# Altium schematic sheet sptArrayX2.SCHDOC: LiveDesign Evaluation - Video Games
size C; Organization: Altium Limited; Address1: L3, 12a Rodborough Rd; Address2: Frenchs Forest; Address3: NSW; Address4: Australia 2086; DocumentNumber: 7; SheetNumber: 7; SheetTotal: 11
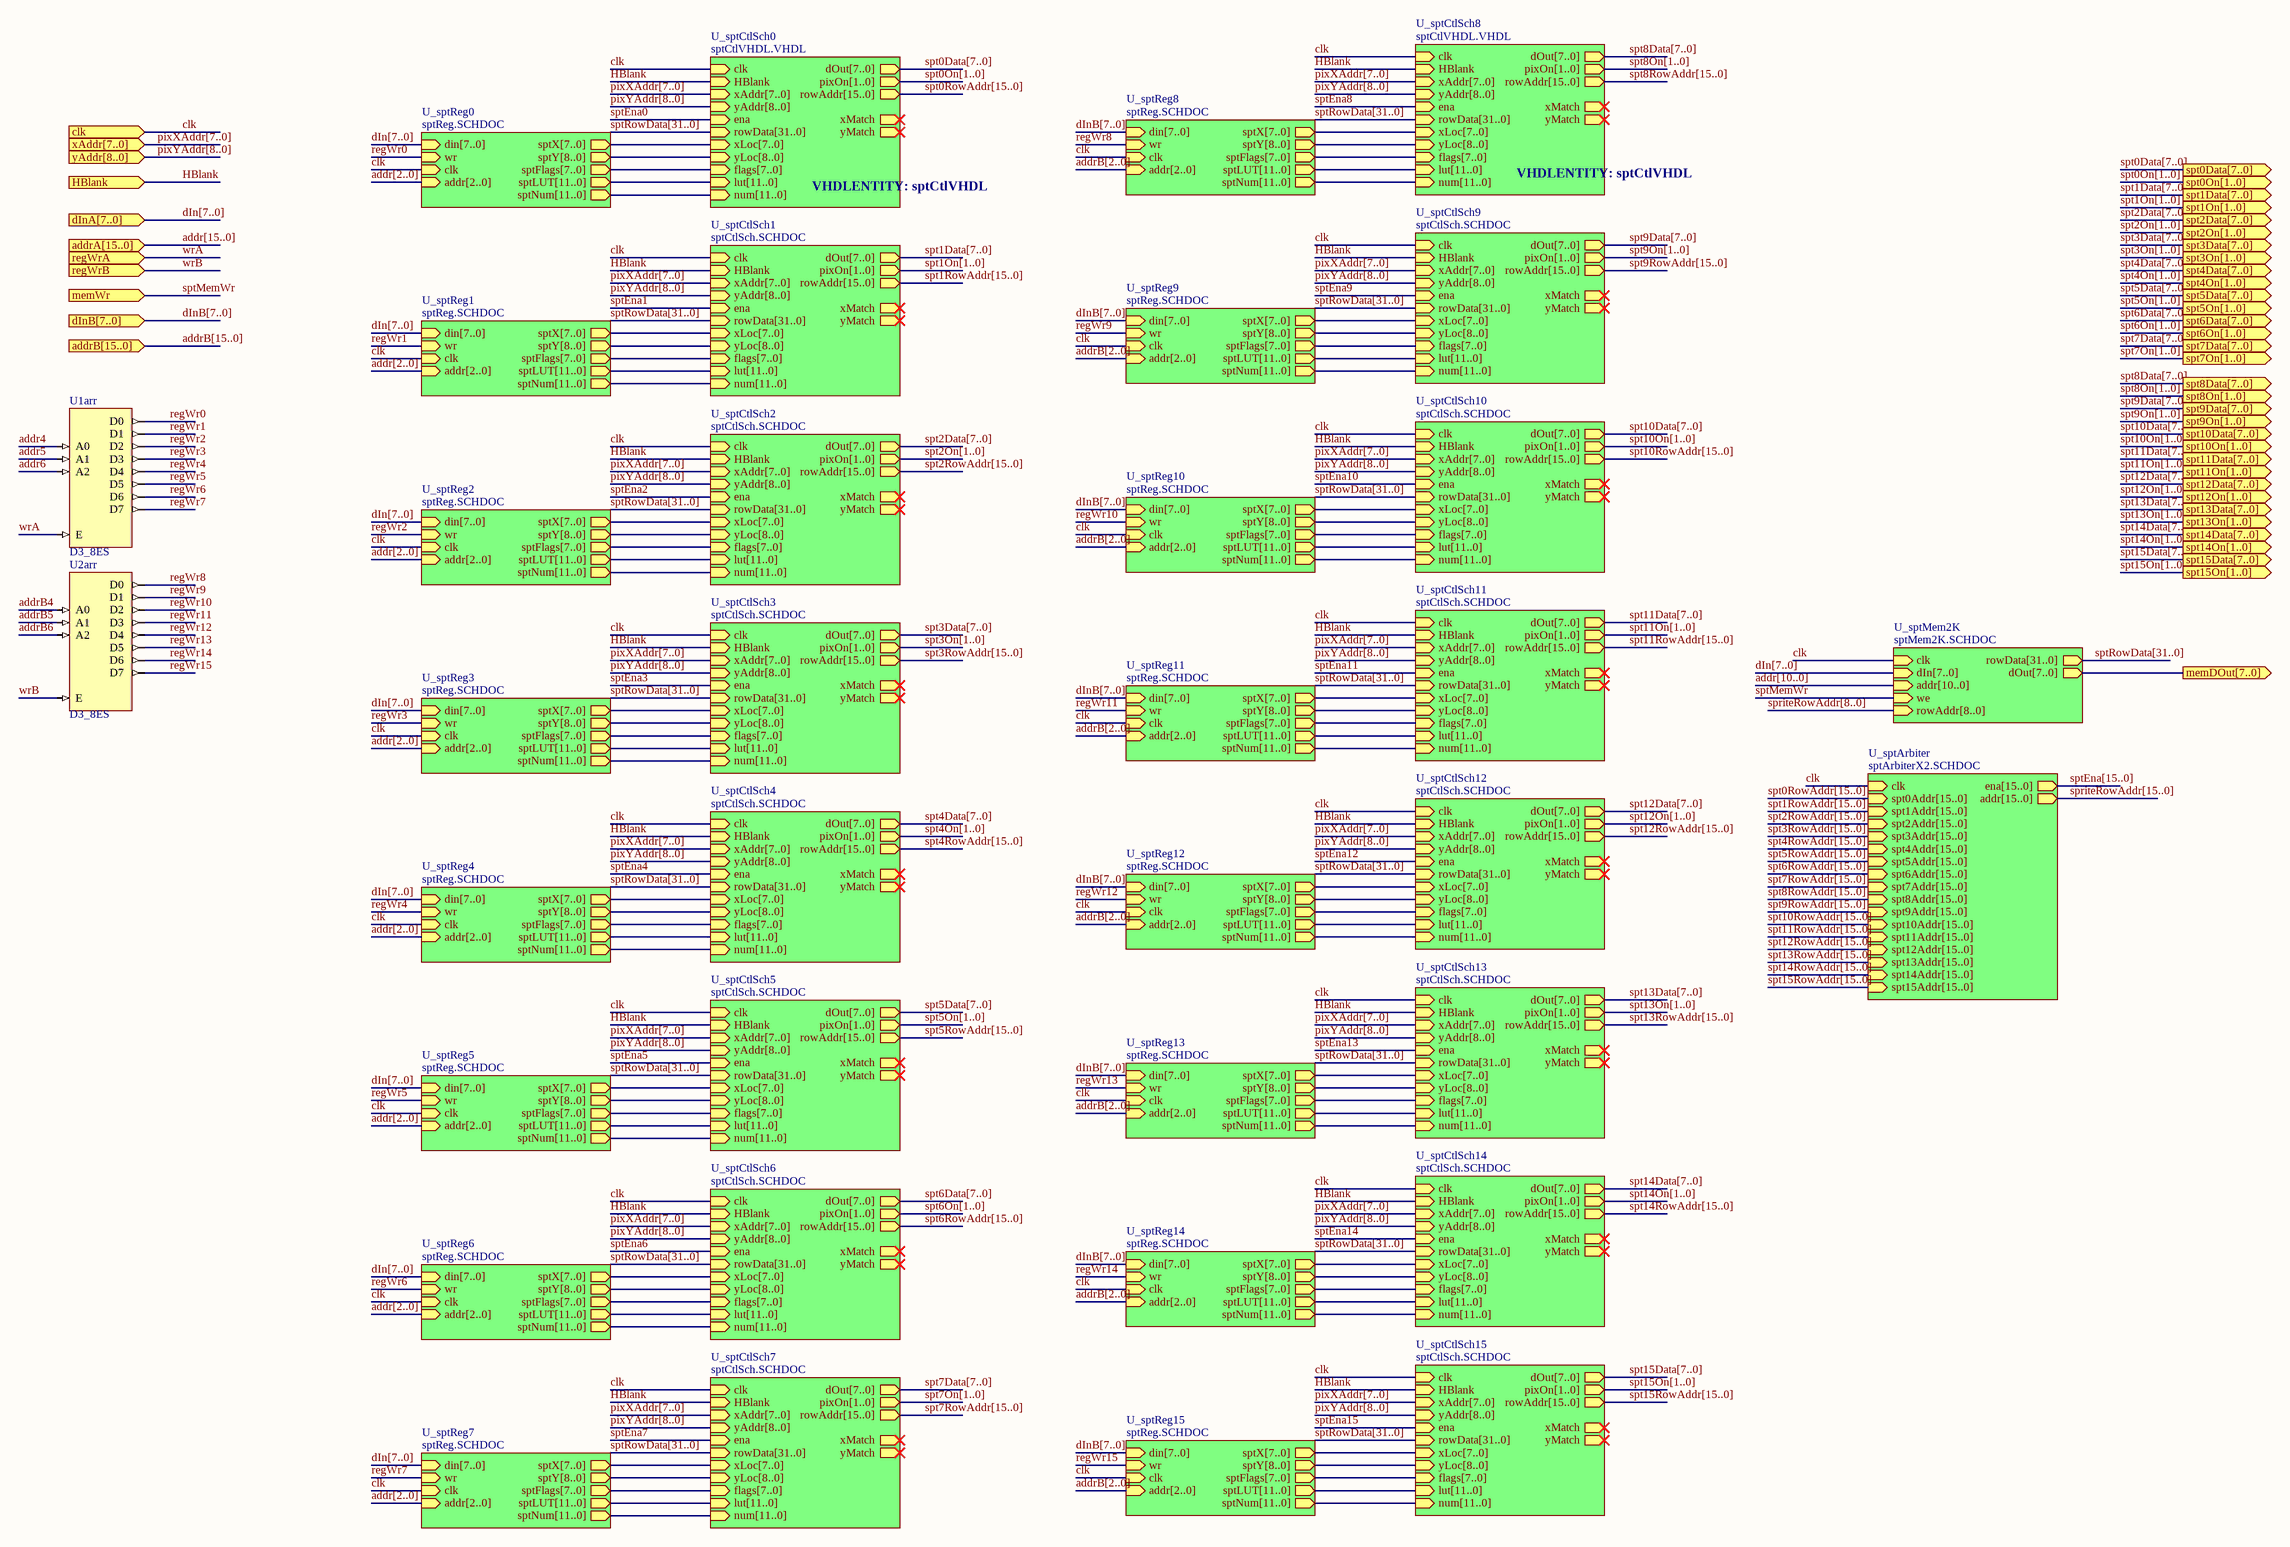
[diagram p0: sptArrayX2.SCHDOC]

## Parts
U1arr  D3_8ES
U2arr  D3_8ES

## Sub-sheets
U_sptArbiter = sptArbiterX2.SCHDOC: ena[15..0] (out), clk (in), addr[15..0] (out), spt0Addr[15..0] (in), spt1Addr[15..0] (in), spt2Addr[15..0] (in), spt3Addr[15..0] (in), spt4Addr[15..0] (in), spt5Addr[15..0] (in), spt6Addr[15..0] (in), spt7Addr[15..0] (in), spt9Addr[15..0] (in), spt8Addr[15..0] (in), spt14Addr[15..0] (in), spt15Addr[15..0] (in), spt11Addr[15..0] (in), spt12Addr[15..0] (in), spt13Addr[15..0] (in), spt10Addr[15..0] (in)
U_sptCtlSch0 = sptCtlVHDL.VHDL: clk (in), HBlank (in), xAddr[7..0] (in), yAddr[8..0] (in), ena (in), xLoc[7..0] (in), rowData[31..0] (in), yLoc[8..0] (in), dOut[7..0] (out), rowAddr[15..0] (out), flags[7..0] (in), lut[11..0] (in), num[11..0] (in), pixOn[1..0] (out), xMatch (out), yMatch (out)  | VHDLENTITY: sptCtlVHDL
U_sptCtlSch1 = sptCtlSch.SCHDOC: clk (in), HBlank (in), xAddr[7..0] (in), yAddr[8..0] (in), ena (in), xLoc[7..0] (in), rowData[31..0] (in), yLoc[8..0] (in), dOut[7..0] (out), rowAddr[15..0] (out), xMatch (out), yMatch (out), flags[7..0] (in), lut[11..0] (in), num[11..0] (in), pixOn[1..0] (out)
U_sptCtlSch2 = sptCtlSch.SCHDOC: clk (in), HBlank (in), xAddr[7..0] (in), yAddr[8..0] (in), ena (in), xLoc[7..0] (in), rowData[31..0] (in), yLoc[8..0] (in), dOut[7..0] (out), rowAddr[15..0] (out), xMatch (out), yMatch (out), flags[7..0] (in), lut[11..0] (in), num[11..0] (in), pixOn[1..0] (out)
U_sptCtlSch3 = sptCtlSch.SCHDOC: clk (in), HBlank (in), xAddr[7..0] (in), yAddr[8..0] (in), ena (in), xLoc[7..0] (in), rowData[31..0] (in), yLoc[8..0] (in), dOut[7..0] (out), rowAddr[15..0] (out), xMatch (out), yMatch (out), flags[7..0] (in), lut[11..0] (in), num[11..0] (in), pixOn[1..0] (out)
U_sptCtlSch4 = sptCtlSch.SCHDOC: clk (in), HBlank (in), xAddr[7..0] (in), yAddr[8..0] (in), ena (in), xLoc[7..0] (in), rowData[31..0] (in), yLoc[8..0] (in), dOut[7..0] (out), rowAddr[15..0] (out), xMatch (out), yMatch (out), flags[7..0] (in), lut[11..0] (in), num[11..0] (in), pixOn[1..0] (out)
U_sptCtlSch5 = sptCtlSch.SCHDOC: clk (in), HBlank (in), xAddr[7..0] (in), yAddr[8..0] (in), ena (in), xLoc[7..0] (in), rowData[31..0] (in), yLoc[8..0] (in), dOut[7..0] (out), rowAddr[15..0] (out), xMatch (out), yMatch (out), flags[7..0] (in), lut[11..0] (in), num[11..0] (in), pixOn[1..0] (out)
U_sptCtlSch6 = sptCtlSch.SCHDOC: clk (in), HBlank (in), xAddr[7..0] (in), yAddr[8..0] (in), ena (in), xLoc[7..0] (in), rowData[31..0] (in), yLoc[8..0] (in), dOut[7..0] (out), rowAddr[15..0] (out), xMatch (out), yMatch (out), flags[7..0] (in), lut[11..0] (in), num[11..0] (in), pixOn[1..0] (out)
U_sptCtlSch7 = sptCtlSch.SCHDOC: clk (in), HBlank (in), xAddr[7..0] (in), yAddr[8..0] (in), ena (in), xLoc[7..0] (in), rowData[31..0] (in), yLoc[8..0] (in), dOut[7..0] (out), rowAddr[15..0] (out), xMatch (out), yMatch (out), flags[7..0] (in), lut[11..0] (in), num[11..0] (in), pixOn[1..0] (out)
U_sptCtlSch8 = sptCtlVHDL.VHDL: clk (in), HBlank (in), xAddr[7..0] (in), yAddr[8..0] (in), ena (in), xLoc[7..0] (in), rowData[31..0] (in), yLoc[8..0] (in), dOut[7..0] (out), rowAddr[15..0] (out), flags[7..0] (in), lut[11..0] (in), num[11..0] (in), pixOn[1..0] (out), xMatch (out), yMatch (out)  | VHDLENTITY: sptCtlVHDL
U_sptCtlSch9 = sptCtlSch.SCHDOC: clk (in), HBlank (in), xAddr[7..0] (in), yAddr[8..0] (in), ena (in), xLoc[7..0] (in), rowData[31..0] (in), yLoc[8..0] (in), dOut[7..0] (out), rowAddr[15..0] (out), xMatch (out), yMatch (out), flags[7..0] (in), lut[11..0] (in), num[11..0] (in), pixOn[1..0] (out)
U_sptCtlSch10 = sptCtlSch.SCHDOC: clk (in), HBlank (in), xAddr[7..0] (in), yAddr[8..0] (in), ena (in), xLoc[7..0] (in), rowData[31..0] (in), yLoc[8..0] (in), dOut[7..0] (out), rowAddr[15..0] (out), xMatch (out), yMatch (out), flags[7..0] (in), lut[11..0] (in), num[11..0] (in), pixOn[1..0] (out)
U_sptCtlSch11 = sptCtlSch.SCHDOC: clk (in), HBlank (in), xAddr[7..0] (in), yAddr[8..0] (in), ena (in), xLoc[7..0] (in), rowData[31..0] (in), yLoc[8..0] (in), dOut[7..0] (out), rowAddr[15..0] (out), xMatch (out), yMatch (out), flags[7..0] (in), lut[11..0] (in), num[11..0] (in), pixOn[1..0] (out)
U_sptCtlSch12 = sptCtlSch.SCHDOC: clk (in), HBlank (in), xAddr[7..0] (in), yAddr[8..0] (in), ena (in), xLoc[7..0] (in), rowData[31..0] (in), yLoc[8..0] (in), dOut[7..0] (out), rowAddr[15..0] (out), xMatch (out), yMatch (out), flags[7..0] (in), lut[11..0] (in), num[11..0] (in), pixOn[1..0] (out)
U_sptCtlSch13 = sptCtlSch.SCHDOC: clk (in), HBlank (in), xAddr[7..0] (in), yAddr[8..0] (in), ena (in), xLoc[7..0] (in), rowData[31..0] (in), yLoc[8..0] (in), dOut[7..0] (out), rowAddr[15..0] (out), xMatch (out), yMatch (out), flags[7..0] (in), lut[11..0] (in), num[11..0] (in), pixOn[1..0] (out)
U_sptCtlSch14 = sptCtlSch.SCHDOC: clk (in), HBlank (in), xAddr[7..0] (in), yAddr[8..0] (in), ena (in), xLoc[7..0] (in), rowData[31..0] (in), yLoc[8..0] (in), dOut[7..0] (out), rowAddr[15..0] (out), xMatch (out), yMatch (out), flags[7..0] (in), lut[11..0] (in), num[11..0] (in), pixOn[1..0] (out)
U_sptCtlSch15 = sptCtlSch.SCHDOC: clk (in), HBlank (in), xAddr[7..0] (in), yAddr[8..0] (in), ena (in), xLoc[7..0] (in), rowData[31..0] (in), yLoc[8..0] (in), dOut[7..0] (out), rowAddr[15..0] (out), xMatch (out), yMatch (out), flags[7..0] (in), lut[11..0] (in), num[11..0] (in), pixOn[1..0] (out)
U_sptMem2K = sptMem2K.SCHDOC: clk (in), dIn[7..0] (in), addr[10..0] (in), we (in), rowData[31..0] (out), rowAddr[8..0] (in), dOut[7..0] (out)
U_sptReg0 = sptReg.SCHDOC: din[7..0] (in), wr (in), clk (in), sptX[7..0] (out), sptY[8..0] (out), sptFlags[7..0] (out), sptLUT[11..0] (out), sptNum[11..0] (out), addr[2..0] (in)
U_sptReg1 = sptReg.SCHDOC: din[7..0] (in), wr (in), clk (in), sptX[7..0] (out), sptY[8..0] (out), sptFlags[7..0] (out), sptLUT[11..0] (out), sptNum[11..0] (out), addr[2..0] (in)
U_sptReg2 = sptReg.SCHDOC: din[7..0] (in), wr (in), clk (in), sptX[7..0] (out), sptY[8..0] (out), sptFlags[7..0] (out), sptLUT[11..0] (out), sptNum[11..0] (out), addr[2..0] (in)
U_sptReg3 = sptReg.SCHDOC: din[7..0] (in), wr (in), clk (in), sptX[7..0] (out), sptY[8..0] (out), sptFlags[7..0] (out), sptLUT[11..0] (out), sptNum[11..0] (out), addr[2..0] (in)
U_sptReg4 = sptReg.SCHDOC: din[7..0] (in), wr (in), clk (in), sptX[7..0] (out), sptY[8..0] (out), sptFlags[7..0] (out), sptLUT[11..0] (out), sptNum[11..0] (out), addr[2..0] (in)
U_sptReg5 = sptReg.SCHDOC: din[7..0] (in), wr (in), clk (in), sptX[7..0] (out), sptY[8..0] (out), sptFlags[7..0] (out), sptLUT[11..0] (out), sptNum[11..0] (out), addr[2..0] (in)
U_sptReg6 = sptReg.SCHDOC: din[7..0] (in), wr (in), clk (in), sptX[7..0] (out), sptY[8..0] (out), sptFlags[7..0] (out), sptLUT[11..0] (out), sptNum[11..0] (out), addr[2..0] (in)
U_sptReg7 = sptReg.SCHDOC: din[7..0] (in), wr (in), clk (in), sptX[7..0] (out), sptY[8..0] (out), sptFlags[7..0] (out), sptLUT[11..0] (out), sptNum[11..0] (out), addr[2..0] (in)
U_sptReg8 = sptReg.SCHDOC: din[7..0] (in), wr (in), clk (in), sptX[7..0] (out), sptY[8..0] (out), sptFlags[7..0] (out), sptLUT[11..0] (out), sptNum[11..0] (out), addr[2..0] (in)
U_sptReg9 = sptReg.SCHDOC: din[7..0] (in), wr (in), clk (in), sptX[7..0] (out), sptY[8..0] (out), sptFlags[7..0] (out), sptLUT[11..0] (out), sptNum[11..0] (out), addr[2..0] (in)
U_sptReg10 = sptReg.SCHDOC: din[7..0] (in), wr (in), clk (in), sptX[7..0] (out), sptY[8..0] (out), sptFlags[7..0] (out), sptLUT[11..0] (out), sptNum[11..0] (out), addr[2..0] (in)
U_sptReg11 = sptReg.SCHDOC: din[7..0] (in), wr (in), clk (in), sptX[7..0] (out), sptY[8..0] (out), sptFlags[7..0] (out), sptLUT[11..0] (out), sptNum[11..0] (out), addr[2..0] (in)
U_sptReg12 = sptReg.SCHDOC: din[7..0] (in), wr (in), clk (in), sptX[7..0] (out), sptY[8..0] (out), sptFlags[7..0] (out), sptLUT[11..0] (out), sptNum[11..0] (out), addr[2..0] (in)
U_sptReg13 = sptReg.SCHDOC: din[7..0] (in), wr (in), clk (in), sptX[7..0] (out), sptY[8..0] (out), sptFlags[7..0] (out), sptLUT[11..0] (out), sptNum[11..0] (out), addr[2..0] (in)
U_sptReg14 = sptReg.SCHDOC: din[7..0] (in), wr (in), clk (in), sptX[7..0] (out), sptY[8..0] (out), sptFlags[7..0] (out), sptLUT[11..0] (out), sptNum[11..0] (out), addr[2..0] (in)
U_sptReg15 = sptReg.SCHDOC: din[7..0] (in), wr (in), clk (in), sptX[7..0] (out), sptY[8..0] (out), sptFlags[7..0] (out), sptLUT[11..0] (out), sptNum[11..0] (out), addr[2..0] (in)

## Ports
addrA[15..0] (in), addrB[15..0] (in), clk (in), dInA[7..0] (in), dInB[7..0] (in), HBlank (in), memDOut[7..0] (out), memWr (in), regWrA (in), regWrB (in), spt0Data[7..0] (out), spt0On[1..0] (out), spt1Data[7..0] (out), spt1On[1..0] (out), spt2Data[7..0] (out), spt2On[1..0] (out), spt3Data[7..0] (out), spt3On[1..0] (out), spt4Data[7..0] (out), spt4On[1..0] (out), spt5Data[7..0] (out), spt5On[1..0] (out), spt6Data[7..0] (out), spt6On[1..0] (out), spt7Data[7..0] (out), spt7On[1..0] (out), spt8Data[7..0] (out), spt8On[1..0] (out), spt9Data[7..0] (out), spt9On[1..0] (out), spt10Data[7..0] (out), spt10On[1..0] (out), spt11Data[7..0] (out), spt11On[1..0] (out), spt12Data[7..0] (out), spt12On[1..0] (out), spt13Data[7..0] (out), spt13On[1..0] (out), spt14Data[7..0] (out), spt14On[1..0] (out), spt15Data[7..0] (out), spt15On[1..0] (out), xAddr[7..0] (in), yAddr[8..0] (in)

## Nets
addr4: U1arr.A0
addr5: U1arr.A1
addr6: U1arr.A2
addrB4: U2arr.A0
addrB5: U2arr.A1
addrB6: U2arr.A2
clk: port clk, sheet U_sptArbiter/clk, sheet U_sptCtlSch0/clk, sheet U_sptCtlSch1/clk, sheet U_sptCtlSch2/clk, sheet U_sptCtlSch3/clk, sheet U_sptCtlSch4/clk, sheet U_sptCtlSch5/clk, sheet U_sptCtlSch6/clk, sheet U_sptCtlSch7/clk, sheet U_sptMem2K/clk, sheet U_sptReg0/clk, sheet U_sptReg1/clk, sheet U_sptReg2/clk, sheet U_sptReg3/clk, sheet U_sptReg4/clk, sheet U_sptReg5/clk, sheet U_sptReg6/clk, sheet U_sptReg7/clk, sheet U_sptCtlSch8/clk, sheet U_sptCtlSch9/clk, sheet U_sptCtlSch10/clk, sheet U_sptCtlSch11/clk, sheet U_sptCtlSch12/clk, sheet U_sptCtlSch13/clk, sheet U_sptCtlSch14/clk, sheet U_sptCtlSch15/clk, sheet U_sptReg8/clk, sheet U_sptReg9/clk, sheet U_sptReg10/clk, sheet U_sptReg11/clk, sheet U_sptReg12/clk, sheet U_sptReg13/clk, sheet U_sptReg14/clk, sheet U_sptReg15/clk
HBlank: port HBlank, sheet U_sptCtlSch0/HBlank, sheet U_sptCtlSch1/HBlank, sheet U_sptCtlSch2/HBlank, sheet U_sptCtlSch3/HBlank, sheet U_sptCtlSch4/HBlank, sheet U_sptCtlSch5/HBlank, sheet U_sptCtlSch6/HBlank, sheet U_sptCtlSch7/HBlank, sheet U_sptCtlSch8/HBlank, sheet U_sptCtlSch9/HBlank, sheet U_sptCtlSch10/HBlank, sheet U_sptCtlSch11/HBlank, sheet U_sptCtlSch12/HBlank, sheet U_sptCtlSch13/HBlank, sheet U_sptCtlSch14/HBlank, sheet U_sptCtlSch15/HBlank
regWr0: U1arr.D0 ; sheet U_sptReg0/wr
regWr1: U1arr.D1 ; sheet U_sptReg1/wr
regWr2: U1arr.D2 ; sheet U_sptReg2/wr
regWr3: U1arr.D3 ; sheet U_sptReg3/wr
regWr4: U1arr.D4 ; sheet U_sptReg4/wr
regWr5: U1arr.D5 ; sheet U_sptReg5/wr
regWr6: U1arr.D6 ; sheet U_sptReg6/wr
regWr7: U1arr.D7 ; sheet U_sptReg7/wr
regWr8: U2arr.D0 ; sheet U_sptReg8/wr
regWr9: U2arr.D1 ; sheet U_sptReg9/wr
regWr10: U2arr.D2 ; sheet U_sptReg10/wr
regWr11: U2arr.D3 ; sheet U_sptReg11/wr
regWr12: U2arr.D4 ; sheet U_sptReg12/wr
regWr13: U2arr.D5 ; sheet U_sptReg13/wr
regWr14: U2arr.D6 ; sheet U_sptReg14/wr
regWr15: U2arr.D7 ; sheet U_sptReg15/wr
sptEna0: sheet U_sptCtlSch0/ena
sptEna1: sheet U_sptCtlSch1/ena
sptEna2: sheet U_sptCtlSch2/ena
sptEna3: sheet U_sptCtlSch3/ena
sptEna4: sheet U_sptCtlSch4/ena
sptEna5: sheet U_sptCtlSch5/ena
sptEna6: sheet U_sptCtlSch6/ena
sptEna7: sheet U_sptCtlSch7/ena
sptEna8: sheet U_sptCtlSch8/ena
sptEna9: sheet U_sptCtlSch9/ena
sptEna10: sheet U_sptCtlSch10/ena
sptEna11: sheet U_sptCtlSch11/ena
sptEna12: sheet U_sptCtlSch12/ena
sptEna13: sheet U_sptCtlSch13/ena
sptEna14: sheet U_sptCtlSch14/ena
sptEna15: sheet U_sptCtlSch15/ena
sptMemWr: port memWr, sheet U_sptMem2K/we
wrA: U1arr.E ; port regWrA
wrB: U2arr.E ; port regWrB

## Buses and harness runs
bus addr[2..0] = sheet U_sptReg0/addr[2..0]
bus addr[2..0] = sheet U_sptReg1/addr[2..0]
bus addr[2..0] = sheet U_sptReg2/addr[2..0]
bus addr[2..0] = sheet U_sptReg3/addr[2..0]
bus addr[2..0] = sheet U_sptReg4/addr[2..0]
bus addr[2..0] = sheet U_sptReg5/addr[2..0]
bus addr[2..0] = sheet U_sptReg6/addr[2..0]
bus addr[2..0] = sheet U_sptReg7/addr[2..0]
bus addr[10..0] = sheet U_sptMem2K/addr[10..0]
bus addr[15..0] = port addrA[15..0]
bus addrB[2..0] = sheet U_sptReg8/addr[2..0]
bus addrB[2..0] = sheet U_sptReg9/addr[2..0]
bus addrB[2..0] = sheet U_sptReg10/addr[2..0]
bus addrB[2..0] = sheet U_sptReg11/addr[2..0]
bus addrB[2..0] = sheet U_sptReg12/addr[2..0]
bus addrB[2..0] = sheet U_sptReg13/addr[2..0]
bus addrB[2..0] = sheet U_sptReg14/addr[2..0]
bus addrB[2..0] = sheet U_sptReg15/addr[2..0]
bus addrB[15..0] = port addrB[15..0]
bus dIn[7..0] = port dInA[7..0]
bus dIn[7..0] = sheet U_sptMem2K/dIn[7..0]
bus dIn[7..0] = sheet U_sptReg0/din[7..0]
bus dIn[7..0] = sheet U_sptReg1/din[7..0]
bus dIn[7..0] = sheet U_sptReg2/din[7..0]
bus dIn[7..0] = sheet U_sptReg3/din[7..0]
bus dIn[7..0] = sheet U_sptReg4/din[7..0]
bus dIn[7..0] = sheet U_sptReg5/din[7..0]
bus dIn[7..0] = sheet U_sptReg6/din[7..0]
bus dIn[7..0] = sheet U_sptReg7/din[7..0]
bus dInB[7..0] = port dInB[7..0]
bus dInB[7..0] = sheet U_sptReg8/din[7..0]
bus dInB[7..0] = sheet U_sptReg9/din[7..0]
bus dInB[7..0] = sheet U_sptReg10/din[7..0]
bus dInB[7..0] = sheet U_sptReg11/din[7..0]
bus dInB[7..0] = sheet U_sptReg12/din[7..0]
bus dInB[7..0] = sheet U_sptReg13/din[7..0]
bus dInB[7..0] = sheet U_sptReg14/din[7..0]
bus dInB[7..0] = sheet U_sptReg15/din[7..0]
bus pixXAddr[7..0] = port xAddr[7..0]
bus pixXAddr[7..0] = sheet U_sptCtlSch0/xAddr[7..0]
bus pixXAddr[7..0] = sheet U_sptCtlSch1/xAddr[7..0]
bus pixXAddr[7..0] = sheet U_sptCtlSch2/xAddr[7..0]
bus pixXAddr[7..0] = sheet U_sptCtlSch3/xAddr[7..0]
bus pixXAddr[7..0] = sheet U_sptCtlSch4/xAddr[7..0]
bus pixXAddr[7..0] = sheet U_sptCtlSch5/xAddr[7..0]
bus pixXAddr[7..0] = sheet U_sptCtlSch6/xAddr[7..0]
bus pixXAddr[7..0] = sheet U_sptCtlSch7/xAddr[7..0]
bus pixXAddr[7..0] = sheet U_sptCtlSch8/xAddr[7..0]
bus pixXAddr[7..0] = sheet U_sptCtlSch9/xAddr[7..0]
bus pixXAddr[7..0] = sheet U_sptCtlSch10/xAddr[7..0]
bus pixXAddr[7..0] = sheet U_sptCtlSch11/xAddr[7..0]
bus pixXAddr[7..0] = sheet U_sptCtlSch12/xAddr[7..0]
bus pixXAddr[7..0] = sheet U_sptCtlSch13/xAddr[7..0]
bus pixXAddr[7..0] = sheet U_sptCtlSch14/xAddr[7..0]
bus pixXAddr[7..0] = sheet U_sptCtlSch15/xAddr[7..0]
bus pixYAddr[8..0] = port yAddr[8..0]
bus pixYAddr[8..0] = sheet U_sptCtlSch0/yAddr[8..0]
bus pixYAddr[8..0] = sheet U_sptCtlSch1/yAddr[8..0]
bus pixYAddr[8..0] = sheet U_sptCtlSch2/yAddr[8..0]
bus pixYAddr[8..0] = sheet U_sptCtlSch3/yAddr[8..0]
bus pixYAddr[8..0] = sheet U_sptCtlSch4/yAddr[8..0]
bus pixYAddr[8..0] = sheet U_sptCtlSch5/yAddr[8..0]
bus pixYAddr[8..0] = sheet U_sptCtlSch6/yAddr[8..0]
bus pixYAddr[8..0] = sheet U_sptCtlSch7/yAddr[8..0]
bus pixYAddr[8..0] = sheet U_sptCtlSch8/yAddr[8..0]
bus pixYAddr[8..0] = sheet U_sptCtlSch9/yAddr[8..0]
bus pixYAddr[8..0] = sheet U_sptCtlSch10/yAddr[8..0]
bus pixYAddr[8..0] = sheet U_sptCtlSch11/yAddr[8..0]
bus pixYAddr[8..0] = sheet U_sptCtlSch12/yAddr[8..0]
bus pixYAddr[8..0] = sheet U_sptCtlSch13/yAddr[8..0]
bus pixYAddr[8..0] = sheet U_sptCtlSch14/yAddr[8..0]
bus pixYAddr[8..0] = sheet U_sptCtlSch15/yAddr[8..0]
bus port memDOut[7..0] = sheet U_sptMem2K/dOut[7..0]
bus sheet U_sptCtlSch0/flags[7..0] = sheet U_sptReg0/sptFlags[7..0]
bus sheet U_sptCtlSch0/lut[11..0] = sheet U_sptReg0/sptLUT[11..0]
bus sheet U_sptCtlSch0/num[11..0] = sheet U_sptReg0/sptNum[11..0]
bus sheet U_sptCtlSch0/xLoc[7..0] = sheet U_sptReg0/sptX[7..0]
bus sheet U_sptCtlSch0/yLoc[8..0] = sheet U_sptReg0/sptY[8..0]
bus sheet U_sptCtlSch1/flags[7..0] = sheet U_sptReg1/sptFlags[7..0]
bus sheet U_sptCtlSch1/lut[11..0] = sheet U_sptReg1/sptLUT[11..0]
bus sheet U_sptCtlSch1/num[11..0] = sheet U_sptReg1/sptNum[11..0]
bus sheet U_sptCtlSch1/xLoc[7..0] = sheet U_sptReg1/sptX[7..0]
bus sheet U_sptCtlSch1/yLoc[8..0] = sheet U_sptReg1/sptY[8..0]
bus sheet U_sptCtlSch2/flags[7..0] = sheet U_sptReg2/sptFlags[7..0]
bus sheet U_sptCtlSch2/lut[11..0] = sheet U_sptReg2/sptLUT[11..0]
bus sheet U_sptCtlSch2/num[11..0] = sheet U_sptReg2/sptNum[11..0]
bus sheet U_sptCtlSch2/xLoc[7..0] = sheet U_sptReg2/sptX[7..0]
bus sheet U_sptCtlSch2/yLoc[8..0] = sheet U_sptReg2/sptY[8..0]
bus sheet U_sptCtlSch3/flags[7..0] = sheet U_sptReg3/sptFlags[7..0]
bus sheet U_sptCtlSch3/lut[11..0] = sheet U_sptReg3/sptLUT[11..0]
bus sheet U_sptCtlSch3/num[11..0] = sheet U_sptReg3/sptNum[11..0]
bus sheet U_sptCtlSch3/xLoc[7..0] = sheet U_sptReg3/sptX[7..0]
bus sheet U_sptCtlSch3/yLoc[8..0] = sheet U_sptReg3/sptY[8..0]
bus sheet U_sptCtlSch4/flags[7..0] = sheet U_sptReg4/sptFlags[7..0]
bus sheet U_sptCtlSch4/lut[11..0] = sheet U_sptReg4/sptLUT[11..0]
bus sheet U_sptCtlSch4/num[11..0] = sheet U_sptReg4/sptNum[11..0]
bus sheet U_sptCtlSch4/xLoc[7..0] = sheet U_sptReg4/sptX[7..0]
bus sheet U_sptCtlSch4/yLoc[8..0] = sheet U_sptReg4/sptY[8..0]
bus sheet U_sptCtlSch5/flags[7..0] = sheet U_sptReg5/sptFlags[7..0]
bus sheet U_sptCtlSch5/lut[11..0] = sheet U_sptReg5/sptLUT[11..0]
bus sheet U_sptCtlSch5/num[11..0] = sheet U_sptReg5/sptNum[11..0]
bus sheet U_sptCtlSch5/xLoc[7..0] = sheet U_sptReg5/sptX[7..0]
bus sheet U_sptCtlSch5/yLoc[8..0] = sheet U_sptReg5/sptY[8..0]
bus sheet U_sptCtlSch6/flags[7..0] = sheet U_sptReg6/sptFlags[7..0]
bus sheet U_sptCtlSch6/lut[11..0] = sheet U_sptReg6/sptLUT[11..0]
bus sheet U_sptCtlSch6/num[11..0] = sheet U_sptReg6/sptNum[11..0]
bus sheet U_sptCtlSch6/xLoc[7..0] = sheet U_sptReg6/sptX[7..0]
bus sheet U_sptCtlSch6/yLoc[8..0] = sheet U_sptReg6/sptY[8..0]
bus sheet U_sptCtlSch7/flags[7..0] = sheet U_sptReg7/sptFlags[7..0]
bus sheet U_sptCtlSch7/lut[11..0] = sheet U_sptReg7/sptLUT[11..0]
bus sheet U_sptCtlSch7/num[11..0] = sheet U_sptReg7/sptNum[11..0]
bus sheet U_sptCtlSch7/xLoc[7..0] = sheet U_sptReg7/sptX[7..0]
bus sheet U_sptCtlSch7/yLoc[8..0] = sheet U_sptReg7/sptY[8..0]
bus sheet U_sptCtlSch8/flags[7..0] = sheet U_sptReg8/sptFlags[7..0]
bus sheet U_sptCtlSch8/lut[11..0] = sheet U_sptReg8/sptLUT[11..0]
bus sheet U_sptCtlSch8/num[11..0] = sheet U_sptReg8/sptNum[11..0]
bus sheet U_sptCtlSch8/xLoc[7..0] = sheet U_sptReg8/sptX[7..0]
bus sheet U_sptCtlSch8/yLoc[8..0] = sheet U_sptReg8/sptY[8..0]
bus sheet U_sptCtlSch9/flags[7..0] = sheet U_sptReg9/sptFlags[7..0]
bus sheet U_sptCtlSch9/lut[11..0] = sheet U_sptReg9/sptLUT[11..0]
bus sheet U_sptCtlSch9/num[11..0] = sheet U_sptReg9/sptNum[11..0]
bus sheet U_sptCtlSch9/xLoc[7..0] = sheet U_sptReg9/sptX[7..0]
bus sheet U_sptCtlSch9/yLoc[8..0] = sheet U_sptReg9/sptY[8..0]
bus sheet U_sptCtlSch10/flags[7..0] = sheet U_sptReg10/sptFlags[7..0]
bus sheet U_sptCtlSch10/lut[11..0] = sheet U_sptReg10/sptLUT[11..0]
bus sheet U_sptCtlSch10/num[11..0] = sheet U_sptReg10/sptNum[11..0]
bus sheet U_sptCtlSch10/xLoc[7..0] = sheet U_sptReg10/sptX[7..0]
bus sheet U_sptCtlSch10/yLoc[8..0] = sheet U_sptReg10/sptY[8..0]
bus sheet U_sptCtlSch11/flags[7..0] = sheet U_sptReg11/sptFlags[7..0]
bus sheet U_sptCtlSch11/lut[11..0] = sheet U_sptReg11/sptLUT[11..0]
bus sheet U_sptCtlSch11/num[11..0] = sheet U_sptReg11/sptNum[11..0]
bus sheet U_sptCtlSch11/xLoc[7..0] = sheet U_sptReg11/sptX[7..0]
bus sheet U_sptCtlSch11/yLoc[8..0] = sheet U_sptReg11/sptY[8..0]
bus sheet U_sptCtlSch12/flags[7..0] = sheet U_sptReg12/sptFlags[7..0]
bus sheet U_sptCtlSch12/lut[11..0] = sheet U_sptReg12/sptLUT[11..0]
bus sheet U_sptCtlSch12/num[11..0] = sheet U_sptReg12/sptNum[11..0]
bus sheet U_sptCtlSch12/xLoc[7..0] = sheet U_sptReg12/sptX[7..0]
bus sheet U_sptCtlSch12/yLoc[8..0] = sheet U_sptReg12/sptY[8..0]
bus sheet U_sptCtlSch13/flags[7..0] = sheet U_sptReg13/sptFlags[7..0]
bus sheet U_sptCtlSch13/lut[11..0] = sheet U_sptReg13/sptLUT[11..0]
bus sheet U_sptCtlSch13/num[11..0] = sheet U_sptReg13/sptNum[11..0]
bus sheet U_sptCtlSch13/xLoc[7..0] = sheet U_sptReg13/sptX[7..0]
bus sheet U_sptCtlSch13/yLoc[8..0] = sheet U_sptReg13/sptY[8..0]
bus sheet U_sptCtlSch14/flags[7..0] = sheet U_sptReg14/sptFlags[7..0]
bus sheet U_sptCtlSch14/lut[11..0] = sheet U_sptReg14/sptLUT[11..0]
bus sheet U_sptCtlSch14/num[11..0] = sheet U_sptReg14/sptNum[11..0]
bus sheet U_sptCtlSch14/xLoc[7..0] = sheet U_sptReg14/sptX[7..0]
bus sheet U_sptCtlSch14/yLoc[8..0] = sheet U_sptReg14/sptY[8..0]
bus sheet U_sptCtlSch15/flags[7..0] = sheet U_sptReg15/sptFlags[7..0]
bus sheet U_sptCtlSch15/lut[11..0] = sheet U_sptReg15/sptLUT[11..0]
bus sheet U_sptCtlSch15/num[11..0] = sheet U_sptReg15/sptNum[11..0]
bus sheet U_sptCtlSch15/xLoc[7..0] = sheet U_sptReg15/sptX[7..0]
bus sheet U_sptCtlSch15/yLoc[8..0] = sheet U_sptReg15/sptY[8..0]
bus spriteRowAddr[8..0] = sheet U_sptMem2K/rowAddr[8..0]
bus spriteRowAddr[15..0] = sheet U_sptArbiter/addr[15..0]
bus spt0Data[7..0] = port spt0Data[7..0]
bus spt0Data[7..0] = sheet U_sptCtlSch0/dOut[7..0]
bus spt0On[1..0] = port spt0On[1..0]
bus spt0On[1..0] = sheet U_sptCtlSch0/pixOn[1..0]
bus spt0RowAddr[15..0] = sheet U_sptArbiter/spt0Addr[15..0]
bus spt0RowAddr[15..0] = sheet U_sptCtlSch0/rowAddr[15..0]
bus spt1Data[7..0] = port spt1Data[7..0]
bus spt1Data[7..0] = sheet U_sptCtlSch1/dOut[7..0]
bus spt1On[1..0] = port spt1On[1..0]
bus spt1On[1..0] = sheet U_sptCtlSch1/pixOn[1..0]
bus spt1RowAddr[15..0] = sheet U_sptArbiter/spt1Addr[15..0]
bus spt1RowAddr[15..0] = sheet U_sptCtlSch1/rowAddr[15..0]
bus spt2Data[7..0] = port spt2Data[7..0]
bus spt2Data[7..0] = sheet U_sptCtlSch2/dOut[7..0]
bus spt2On[1..0] = port spt2On[1..0]
bus spt2On[1..0] = sheet U_sptCtlSch2/pixOn[1..0]
bus spt2RowAddr[15..0] = sheet U_sptArbiter/spt2Addr[15..0]
bus spt2RowAddr[15..0] = sheet U_sptCtlSch2/rowAddr[15..0]
bus spt3Data[7..0] = port spt3Data[7..0]
bus spt3Data[7..0] = sheet U_sptCtlSch3/dOut[7..0]
bus spt3On[1..0] = port spt3On[1..0]
bus spt3On[1..0] = sheet U_sptCtlSch3/pixOn[1..0]
bus spt3RowAddr[15..0] = sheet U_sptArbiter/spt3Addr[15..0]
bus spt3RowAddr[15..0] = sheet U_sptCtlSch3/rowAddr[15..0]
bus spt4Data[7..0] = port spt4Data[7..0]
bus spt4Data[7..0] = sheet U_sptCtlSch4/dOut[7..0]
bus spt4On[1..0] = port spt4On[1..0]
bus spt4On[1..0] = sheet U_sptCtlSch4/pixOn[1..0]
bus spt4RowAddr[15..0] = sheet U_sptArbiter/spt4Addr[15..0]
bus spt4RowAddr[15..0] = sheet U_sptCtlSch4/rowAddr[15..0]
bus spt5Data[7..0] = port spt5Data[7..0]
bus spt5Data[7..0] = sheet U_sptCtlSch5/dOut[7..0]
bus spt5On[1..0] = port spt5On[1..0]
bus spt5On[1..0] = sheet U_sptCtlSch5/pixOn[1..0]
bus spt5RowAddr[15..0] = sheet U_sptArbiter/spt5Addr[15..0]
bus spt5RowAddr[15..0] = sheet U_sptCtlSch5/rowAddr[15..0]
bus spt6Data[7..0] = port spt6Data[7..0]
bus spt6Data[7..0] = sheet U_sptCtlSch6/dOut[7..0]
bus spt6On[1..0] = port spt6On[1..0]
bus spt6On[1..0] = sheet U_sptCtlSch6/pixOn[1..0]
bus spt6RowAddr[15..0] = sheet U_sptArbiter/spt6Addr[15..0]
bus spt6RowAddr[15..0] = sheet U_sptCtlSch6/rowAddr[15..0]
bus spt7Data[7..0] = port spt7Data[7..0]
bus spt7Data[7..0] = sheet U_sptCtlSch7/dOut[7..0]
bus spt7On[1..0] = port spt7On[1..0]
bus spt7On[1..0] = sheet U_sptCtlSch7/pixOn[1..0]
bus spt7RowAddr[15..0] = sheet U_sptArbiter/spt7Addr[15..0]
bus spt7RowAddr[15..0] = sheet U_sptCtlSch7/rowAddr[15..0]
bus spt8Data[7..0] = port spt8Data[7..0]
bus spt8Data[7..0] = sheet U_sptCtlSch8/dOut[7..0]
bus spt8On[1..0] = port spt8On[1..0]
bus spt8On[1..0] = sheet U_sptCtlSch8/pixOn[1..0]
bus spt8RowAddr[15..0] = sheet U_sptArbiter/spt8Addr[15..0]
bus spt8RowAddr[15..0] = sheet U_sptCtlSch8/rowAddr[15..0]
bus spt9Data[7..0] = port spt9Data[7..0]
bus spt9Data[7..0] = sheet U_sptCtlSch9/dOut[7..0]
bus spt9On[1..0] = port spt9On[1..0]
bus spt9On[1..0] = sheet U_sptCtlSch9/pixOn[1..0]
bus spt9RowAddr[15..0] = sheet U_sptArbiter/spt9Addr[15..0]
bus spt9RowAddr[15..0] = sheet U_sptCtlSch9/rowAddr[15..0]
bus spt10Data[7..0] = port spt10Data[7..0]
bus spt10Data[7..0] = sheet U_sptCtlSch10/dOut[7..0]
bus spt10On[1..0] = port spt10On[1..0]
bus spt10On[1..0] = sheet U_sptCtlSch10/pixOn[1..0]
bus spt10RowAddr[15..0] = sheet U_sptArbiter/spt10Addr[15..0]
bus spt10RowAddr[15..0] = sheet U_sptCtlSch10/rowAddr[15..0]
bus spt11Data[7..0] = port spt11Data[7..0]
bus spt11Data[7..0] = sheet U_sptCtlSch11/dOut[7..0]
bus spt11On[1..0] = port spt11On[1..0]
bus spt11On[1..0] = sheet U_sptCtlSch11/pixOn[1..0]
bus spt11RowAddr[15..0] = sheet U_sptArbiter/spt11Addr[15..0]
bus spt11RowAddr[15..0] = sheet U_sptCtlSch11/rowAddr[15..0]
bus spt12Data[7..0] = port spt12Data[7..0]
bus spt12Data[7..0] = sheet U_sptCtlSch12/dOut[7..0]
bus spt12On[1..0] = port spt12On[1..0]
bus spt12On[1..0] = sheet U_sptCtlSch12/pixOn[1..0]
bus spt12RowAddr[15..0] = sheet U_sptArbiter/spt12Addr[15..0]
bus spt12RowAddr[15..0] = sheet U_sptCtlSch12/rowAddr[15..0]
bus spt13Data[7..0] = port spt13Data[7..0]
bus spt13Data[7..0] = sheet U_sptCtlSch13/dOut[7..0]
bus spt13On[1..0] = port spt13On[1..0]
bus spt13On[1..0] = sheet U_sptCtlSch13/pixOn[1..0]
bus spt13RowAddr[15..0] = sheet U_sptArbiter/spt13Addr[15..0]
bus spt13RowAddr[15..0] = sheet U_sptCtlSch13/rowAddr[15..0]
bus spt14Data[7..0] = port spt14Data[7..0]
bus spt14Data[7..0] = sheet U_sptCtlSch14/dOut[7..0]
bus spt14On[1..0] = port spt14On[1..0]
bus spt14On[1..0] = sheet U_sptCtlSch14/pixOn[1..0]
bus spt14RowAddr[15..0] = sheet U_sptArbiter/spt14Addr[15..0]
bus spt14RowAddr[15..0] = sheet U_sptCtlSch14/rowAddr[15..0]
bus spt15Data[7..0] = port spt15Data[7..0]
bus spt15Data[7..0] = sheet U_sptCtlSch15/dOut[7..0]
bus spt15On[1..0] = port spt15On[1..0]
bus spt15On[1..0] = sheet U_sptCtlSch15/pixOn[1..0]
bus spt15RowAddr[15..0] = sheet U_sptArbiter/spt15Addr[15..0]
bus spt15RowAddr[15..0] = sheet U_sptCtlSch15/rowAddr[15..0]
bus sptEna[15..0] = sheet U_sptArbiter/ena[15..0]
bus sptRowData[31..0] = sheet U_sptCtlSch0/rowData[31..0]
bus sptRowData[31..0] = sheet U_sptCtlSch1/rowData[31..0]
bus sptRowData[31..0] = sheet U_sptCtlSch2/rowData[31..0]
bus sptRowData[31..0] = sheet U_sptCtlSch3/rowData[31..0]
bus sptRowData[31..0] = sheet U_sptCtlSch4/rowData[31..0]
bus sptRowData[31..0] = sheet U_sptCtlSch5/rowData[31..0]
bus sptRowData[31..0] = sheet U_sptCtlSch6/rowData[31..0]
bus sptRowData[31..0] = sheet U_sptCtlSch7/rowData[31..0]
bus sptRowData[31..0] = sheet U_sptCtlSch8/rowData[31..0]
bus sptRowData[31..0] = sheet U_sptCtlSch9/rowData[31..0]
bus sptRowData[31..0] = sheet U_sptCtlSch10/rowData[31..0]
bus sptRowData[31..0] = sheet U_sptCtlSch11/rowData[31..0]
bus sptRowData[31..0] = sheet U_sptCtlSch12/rowData[31..0]
bus sptRowData[31..0] = sheet U_sptCtlSch13/rowData[31..0]
bus sptRowData[31..0] = sheet U_sptCtlSch14/rowData[31..0]
bus sptRowData[31..0] = sheet U_sptCtlSch15/rowData[31..0]
bus sptRowData[31..0] = sheet U_sptMem2K/rowData[31..0]

## Notes on the sheet
- Title
- Size:
- Date:
- File:
- C
- Number:
- Time:
- Revision:
- Sheet
- of

## Library data of the parts
U1arr U2arr = D3_8ES: Binary 3- to 8-Bit Decoder with Enable, Single Pin Version; Xilinx Equivalent: D3_8E; ArchiveName: GENERIC; Published: 7-Nov-2003; Publisher: Altium Limited; Core Revision: 1.00.00